# EAGLE design pid_projekat (EAGLE 7.4.0)
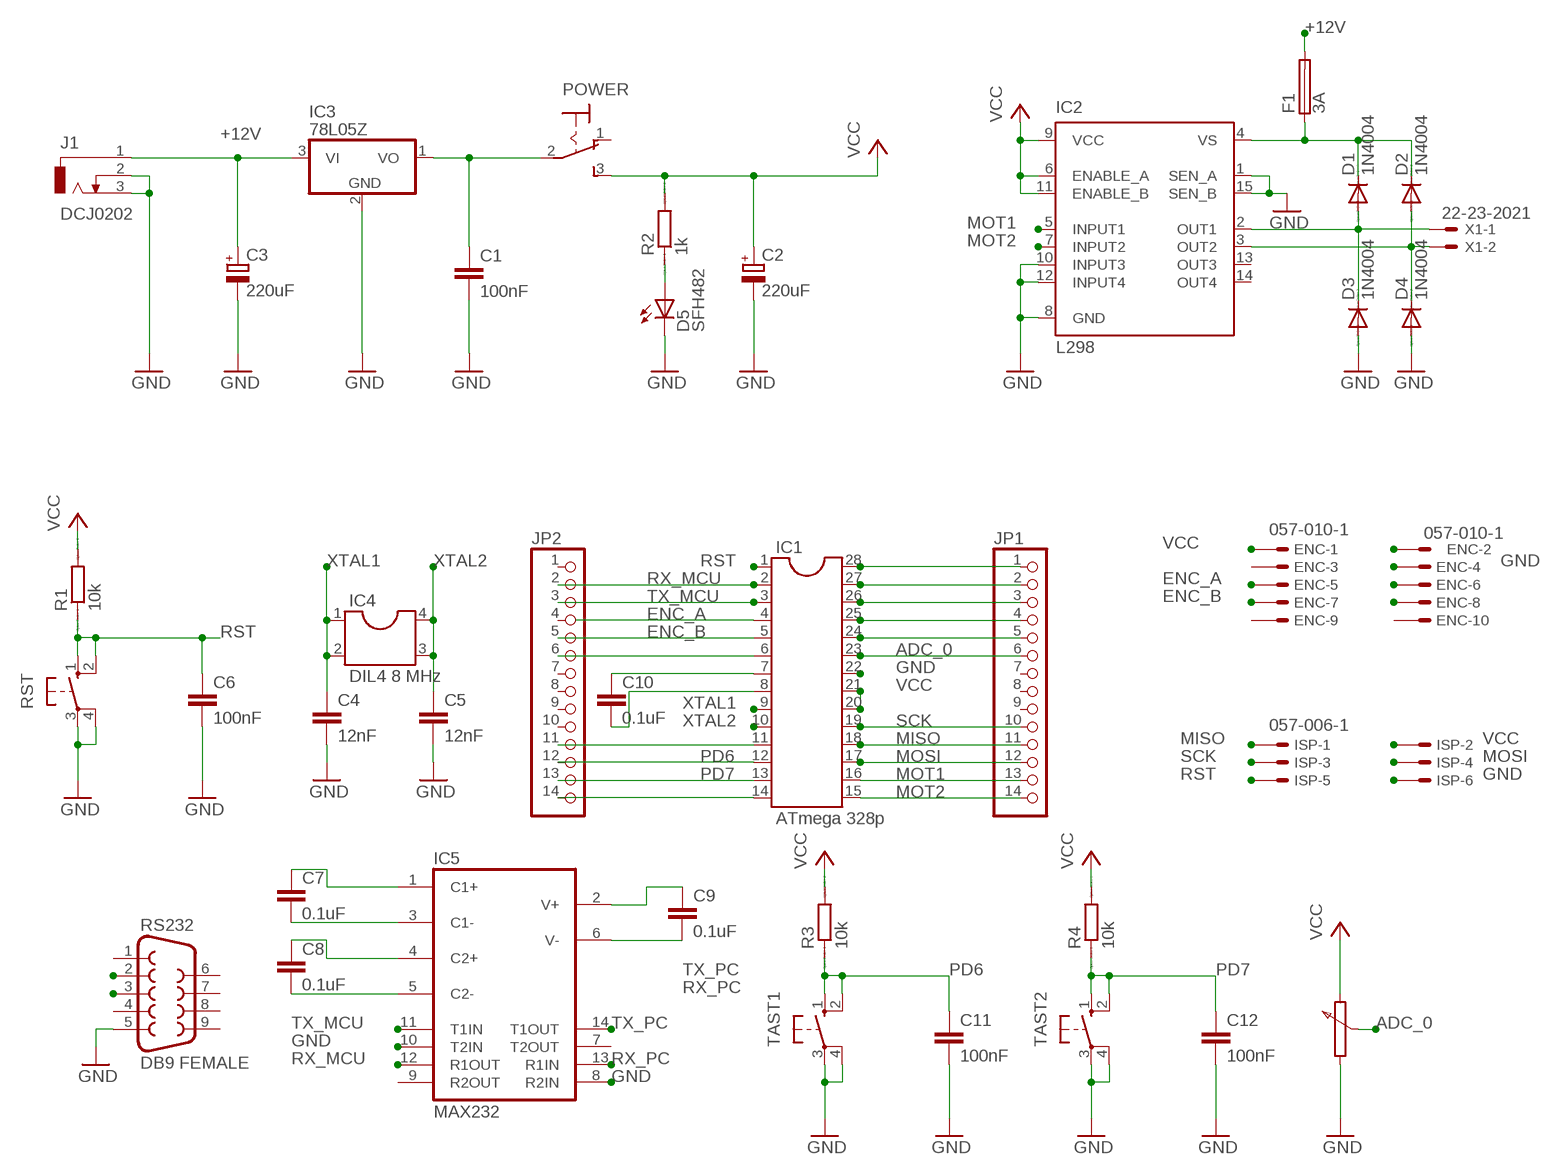
[diagram p0: schematic, sheet 1]

## Parts
C1  100nF  C2,5-3  [C2.5-3]
C2  220uF  CPOL-EUE2,5-6E  [E2,5-6E]
C3  220uF  CPOL-EUE2,5-6E  [E2,5-6E]
C4  12nF  C2,5-3  [C2.5-3]
C5  12nF  C2,5-3  [C2.5-3]
C6  100nF  C2,5-3  [C2.5-3]
C7  0.1uF  C2,5-3  [C2.5-3]
C8  0.1uF  C2,5-3  [C2.5-3]
C9  0.1uF  C2,5-3  [C2.5-3]
C10  0.1uF  C2,5-3  [C2.5-3]
C11  100nF  C2,5-3  [C2.5-3]
C12  100nF  C2,5-3  [C2.5-3]
D1  1N4004  [DO41-10]
D2  1N4004  [DO41-10]
D3  1N4004  [DO41-10]
D4  1N4004  [DO41-10]
D5  SFH482  [SFH482]
ENC  057-010-1  [057-010-1]
F1  3A  GSH15  [GSH15]
IC1  ATmega 328p  DIL28  [DIL28-6]
IC2  L298  [MULTIWATT-15]
IC3  78L05Z  [TO92]
IC4  DIL4 8 MHz  DIL4  [DIL04]
IC5  MAX232  [DIL16]
ISP  057-006-1  [057-006-1]
J1  DCJ0202  [DCJ0202]
JP1  PINHD-1X14  [1X14]
JP2  PINHD-1X14  [1X14]
POWER  320-916  [320-916]
R1  10k  R0204/7  [0204/7]
R2  1k  R0204/7  [0204/7]
R3  10k  R0204/7  [0204/7]
R4  10k  R0204/7  [0204/7]
RS232  DB9 FEMALE  F09HP  [F09HP]
RST  10-XX  [B3F-10XX]
TAST1  10-XX  [B3F-10XX]
TAST2  10-XX  [B3F-10XX]
X1  22-23-2021  [22-23-2021]

## Nets
+12V: C3.+ F1.2 IC3.3(VI) J1.1
ADC_0: IC1.23 JP1.6
ENC_A: ENC.5 IC1.4 IC1.26 JP1.3
ENC_AINV: ENC.6 IC1.24 JP1.5
ENC_B: ENC.7 IC1.5 IC1.25 JP1.4 JP2.5
ENC_BINV: ENC.8
GND: C1.2 C2.- C3.- C4.2 C5.2 C6.2 C11.2 C12.2 D3.A D4.A D5.K(C) ENC.4 IC1.22 IC2.1(SEN_A) IC2.8(GND) IC2.10(INPUT3) IC2.12(INPUT4) IC2.15(SEN_B) IC3.2(GND) IC5.8(R2IN) IC5.10(T2IN) ISP.6 J1.2 J1.3 RS232.5 RST.3(P) RST.4(P1) TAST1.3(P) TAST1.4(P1) TAST2.3(P) TAST2.4(P1)
MISO: IC1.18 ISP.1 JP1.11
MOSI: IC1.17 ISP.4 JP1.12
MOT1: IC1.16 IC1.28 IC2.5(INPUT1) JP1.1 JP1.13
MOT2: IC1.15 IC1.27 IC2.7(INPUT2) JP1.2 JP1.14
MOT+: D1.A D3.C IC2.2(OUT1) X1.1
MOT-: D2.A D4.C IC2.3(OUT2) X1.2
N$1: C9.2 IC5.6(V-)
N$2: C9.1 IC5.2(V+)
N$3: C1.1 IC3.1(VO) POWER.2(P)
N$4: D5.A R2.1
N$8: IC1.6 JP2.6
N$9: ENC.2
N$10: C7.2 IC5.3(C1-)
N$11: C7.1 IC5.1(C1+)
N$12: IC1.11 JP2.11
N$13: C8.1 IC5.4(C2+)
N$15: C8.2 IC5.5(C2-)
N$17: IC1.14 JP2.14
N$21: C10.1 IC1.7
N$22: C10.2 IC1.8
PD6: C11.1 IC1.12 JP2.12 R3.1 TAST1.1(S) TAST1.2(S1)
PD7: C12.1 IC1.13 JP2.13 R4.1 TAST2.1(S) TAST2.2(S1)
RST: C6.1 IC1.1 ISP.5 R1.1 RST.1(S) RST.2(S1)
RX_MCU: IC1.2 IC5.12(R1OUT) JP2.2
RX_PC: IC5.13(R1IN) RS232.3
SCK: IC1.19 ISP.3 JP1.10
TX_MCU: IC1.3 IC5.11(T1IN) JP2.3
TX_PC: IC5.14(T1OUT) RS232.2
VCC: C2.+ ENC.1 IC1.20 IC1.21 IC2.6(ENABLE_A) IC2.9(VCC) IC2.11(ENABLE_B) ISP.2 POWER.3(S) R1.2 R2.2 R3.2 R4.2
VS: D1.C D2.C F1.1 IC2.4(VS)
XTAL1: C4.1 IC1.9 IC4.1 IC4.2
XTAL2: C5.1 IC1.10 IC4.3 IC4.4
Unconnected: ENC.3 ENC.9 ENC.10 IC2.13(OUT3) IC2.14(OUT4) IC5.7(T2OUT) IC5.9(R2OUT) JP1.7 JP1.8 JP1.9 JP2.1 JP2.4 JP2.7 JP2.8 JP2.9 JP2.10 POWER.1(O) RS232.1 RS232.4 RS232.6 RS232.7 RS232.8 RS232.9

## Power pins joined to a net without a drawn wire
GND: IC5.15(GND)
VCC: IC5.16(VCC)

## Library data of the parts
C1 C4-C12 = capacitor-wima:C: CAPACITOR naming: grid - package width
C2 C3 = rcl:CPOL-EU: POLARIZED CAPACITOR, European symbol
D1-D4 = diode:1N4004: DIODE general purpose rectifier, 1 A
D5 = led:SFH482: IR LED infrared emitting diode, Infineon
ENC = con-panduit:057-010-: CONNECTOR 10-pin series 057 contact pc board low profile headers; OC_FARNELL: unknown; OC_NEWARK: unknown
F1 = fuse:GSH15: FUSE HOLDER grid 15mm, 19649 Wickmann; MPN: 64900001039; OC_FARNELL: 1271673; OC_NEWARK: 02P0318
IC1 = ic-package:DIL28: Dual In Line
IC2 = st-microelectronics:L298: DUAL FULL-BRIDGE DRIVER; MPN: L298N; OC_FARNELL: 1589425; OC_NEWARK: 32M1527
IC3 = linear:78*: Positive VOLTAGE REGULATOR Source: http://cache.national.com/ds/LM/LM78L05.pdf http://www.fairchildsemi.com/ds/LM/LM7805.pdf
IC4 = ic-package:DIL4: Dual In Line / Socket
IC5 = maxim:MAX232: RS232 TRANSCEIVER; MF: MAXIM; MPN: MAX232ACPE+; OC_FARNELL: 9723773; OC_NEWARK: 68K4544
ISP = con-panduit:057-006-: CONNECTOR 6-pin series 057 contact pc board low profile headers; OC_FARNELL: unknown; OC_NEWARK: unknown
J1 = con-jack:DCJ0202: DC POWER JACK Source: DCJ0202.pdf; OC_FARNELL: unknown; OC_NEWARK: unknown
JP1 JP2 = pinhead:PINHD-1X14: PIN HEADER
POWER = switch:320-916: TOGGLE SWITCH distributor RS Components
R1-R4 = eagle-ltspice:R: RESISTOR, European symbol; SPICEMODEL: NONE; SPICEPREFIX: R
RS232 = con-subd:F09: SUB-D; OC_FARNELL: unknown; OC_NEWARK: unknown
RST TAST1 TAST2 = switch-omron:10-XX: OMRON SWITCH; MPN: B3F-1000; OC_FARNELL: 176432; OC_NEWARK: 36M3542
X1 = con-molex:22-23-2021: .100" (2.54mm) Center Header - 2 Pin; MF: MOLEX; MPN: 22-23-2021; OC_FARNELL: 1462926; OC_NEWARK: 25C3832

## Board
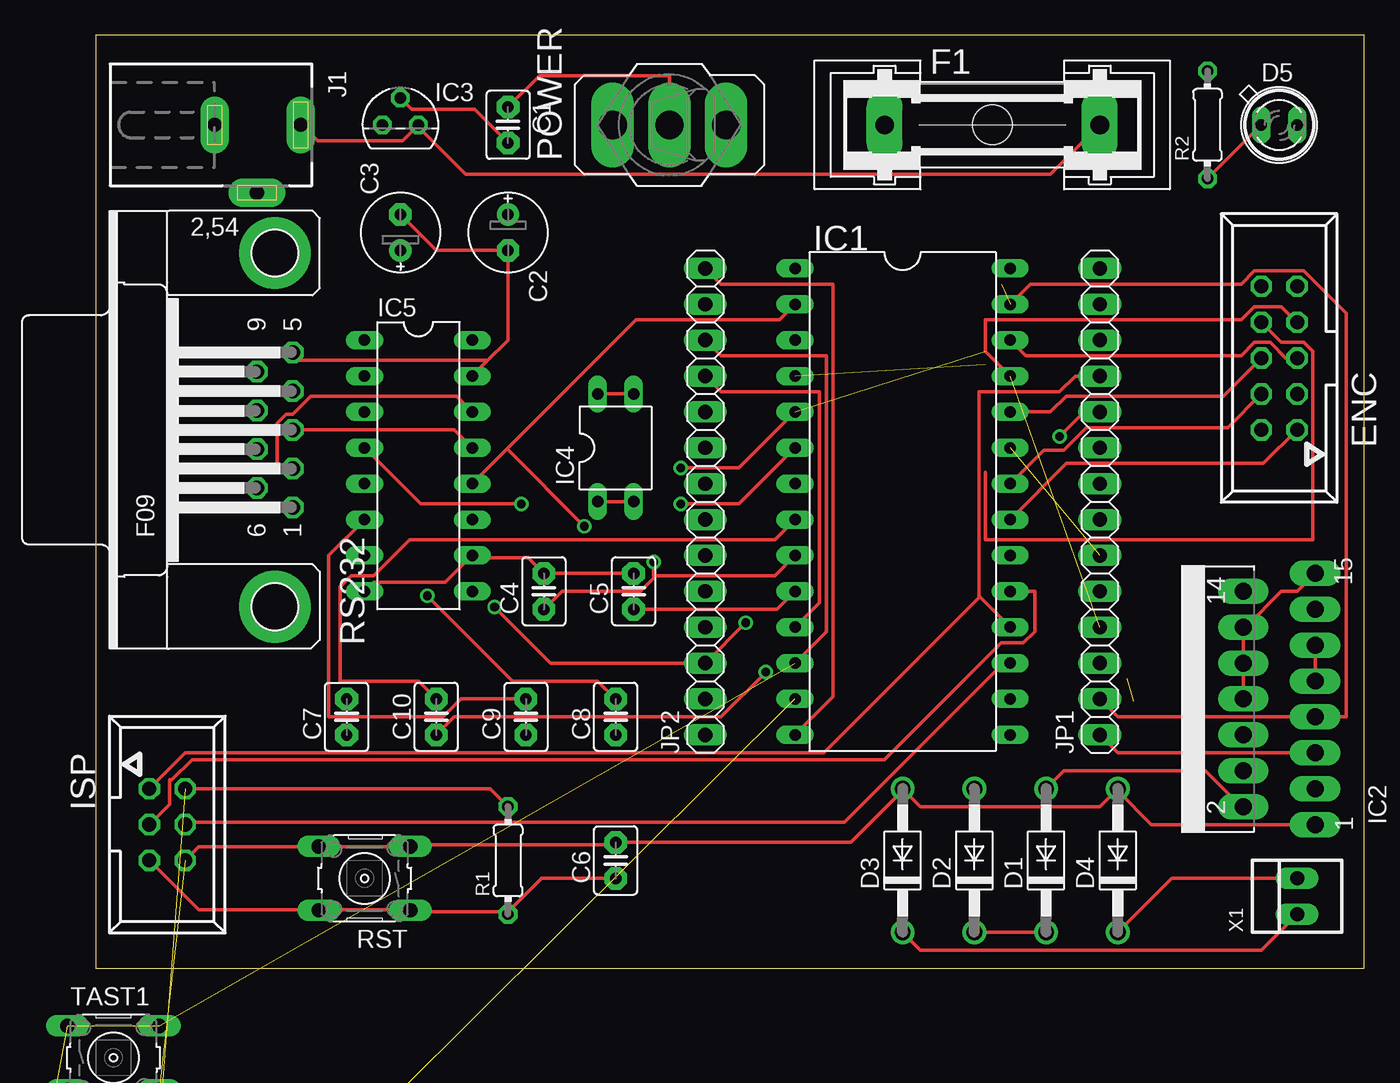
[diagram p1: board, top side]
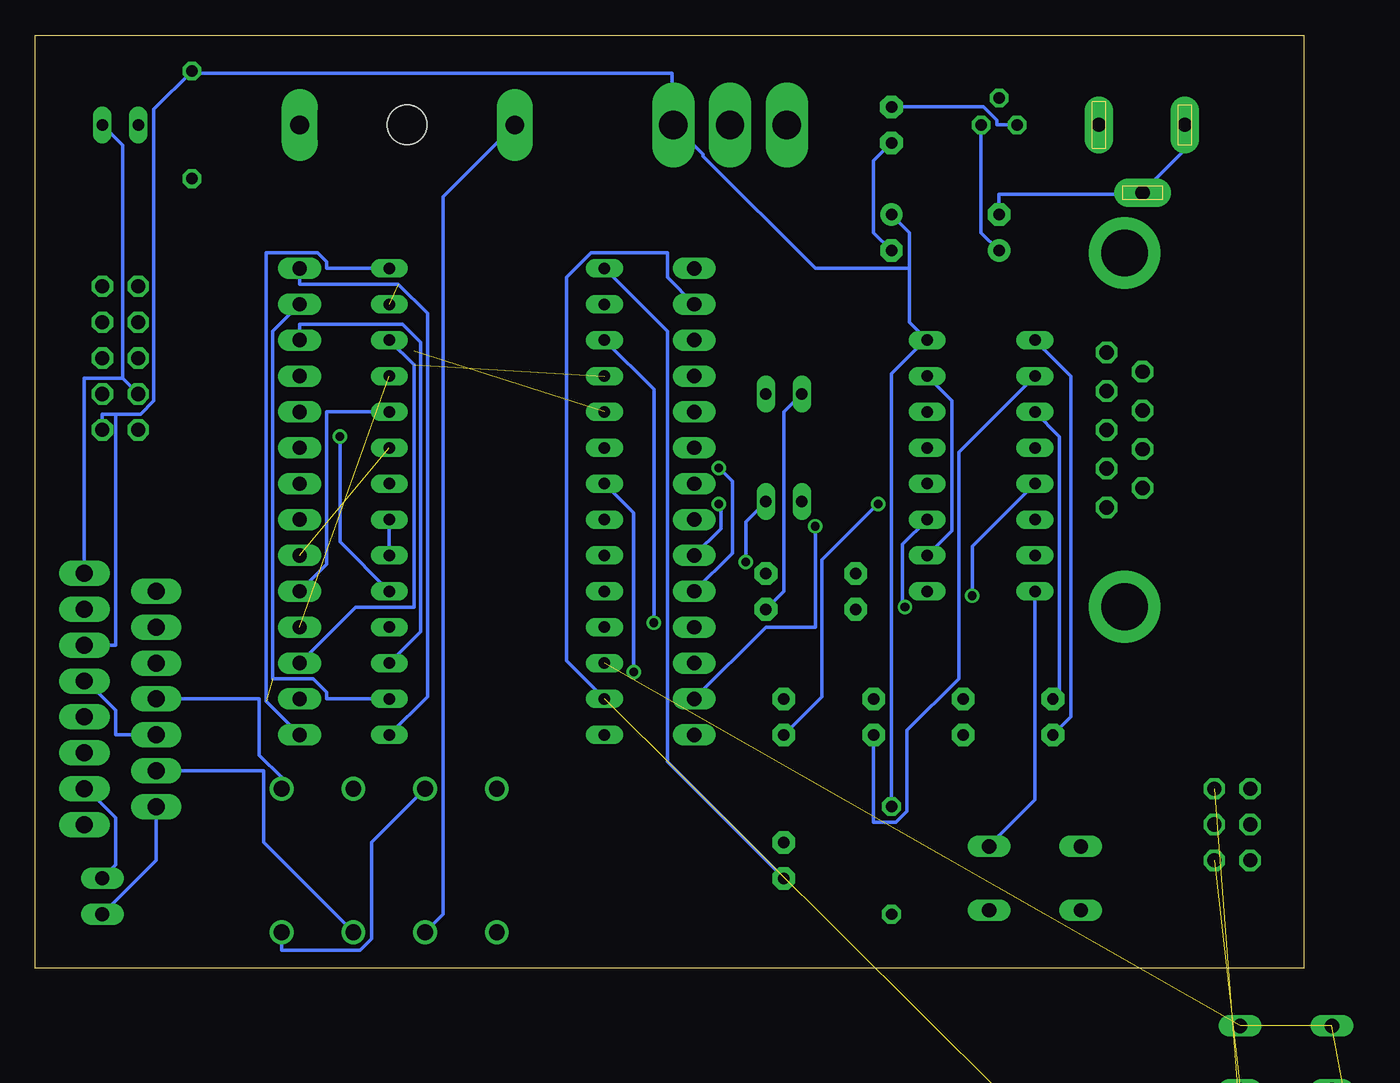
[diagram p2: board, bottom side, seen from below]

Size 89.84 x 66.03 mm. Coordinates in mm from the lower left corner, seen from the top.
Outline: 0,0 89.84,0 89.84,66.03 0,66.03 0,0
Copper layers (1*16): Top 0.035mm / dielectric 1.5mm / Bottom 0.035mm
Design rules "default": minimum track width 10mil, minimum drill 24mil, track to track 8mil, track to pad 8mil, pad to pad 8mil, via to via 8mil, smd to smd 8mil, copper to edge 40mil, drill to drill 8mil, minimum pad ring 10mil, minimum via ring 8mil, stop-mask expansion 4mil, vias tented up to drill 0mil, thermal gap 10mil

### Footprints (pad centres in the part's own frame; a part is rotated, then mirrored left to right if it is on the bottom)
C2.5-3 = drill 0.813 pad 1.6 octagon: 1 -1.27,0; 2 1.27,0
E2,5-6E = drill 0.813 pad 1.575: + -1.27,0 | drill 0.813 pad 1.575 octagon: - 1.27,0
DO41-10 = drill 1.118: A 5.08,0; C -5.08,0
SFH482 = drill 0.813 long: A -1.27,0; K 1.27,0
057-010-1 = drill 1 octagon: 1 -5.08,-1.27; 2 -5.08,1.27; 3 -2.54,-1.27; 4 -2.54,1.27; 5 0,-1.27; 6 0,1.27; 7 2.54,-1.27; 8 2.54,1.27; 9 5.08,-1.27; 10 5.08,1.27
GSH15 = drill 1.321 pad 2.54 long: 1 -7.62,0; 2 7.62,0 | hole 2.794: 0,0
DIL28-6 = drill 0.813 long: 1 -16.51,-7.62; 2 -13.97,-7.62; 3 -11.43,-7.62; 4 -8.89,-7.62; 5 -6.35,-7.62; 6 -3.81,-7.62; 7 -1.27,-7.62; 8 1.27,-7.62; 9 3.81,-7.62; 10 6.35,-7.62; 11 8.89,-7.62; 12 11.43,-7.62; 13 13.97,-7.62; 14 16.51,-7.62; 15 16.51,7.62; 16 13.97,7.62; 17 11.43,7.62; 18 8.89,7.62; 19 6.35,7.62; 20 3.81,7.62; 21 1.27,7.62; 22 -1.27,7.62; 23 -3.81,7.62; 24 -6.35,7.62; 25 -8.89,7.62; 26 -11.43,7.62; 27 -13.97,7.62; 28 -16.51,7.62
MULTIWATT-15 = drill 1.2 long: 1 -8.89,-7.62; 2 -7.62,-2.54; 3 -6.35,-7.62; 4 -5.08,-2.54; 5 -3.81,-7.62; 6 -2.54,-2.54; 7 -1.27,-7.62; 8 0,-2.54; 9 1.27,-7.62; 10 2.54,-2.54; 11 3.81,-7.62; 12 5.08,-2.54; 13 6.35,-7.62; 14 7.62,-2.54; 15 8.89,-7.62
TO92 = drill 0.813 octagon: 1 -1.27,0; 2 0,1.905; 3 1.27,0
DIL04 = drill 0.813 long: 1 -1.27,-3.81; 2 1.27,-3.81; 3 1.27,3.81; 4 -1.27,3.81
DIL16 = drill 0.813 long: 1 -8.89,-3.81; 2 -6.35,-3.81; 3 -3.81,-3.81; 4 -1.27,-3.81; 5 1.27,-3.81; 6 3.81,-3.81; 7 6.35,-3.81; 8 8.89,-3.81; 9 8.89,3.81; 10 6.35,3.81; 11 3.81,3.81; 12 1.27,3.81; 13 -1.27,3.81; 14 -3.81,3.81; 15 -6.35,3.81; 16 -8.89,3.81
057-006-1 = drill 1 octagon: 1 -2.54,-1.27; 2 -2.54,1.27; 3 0,-1.27; 4 0,1.27; 5 2.54,-1.27; 6 2.54,1.27
DCJ0202 = drill 1 pad 2 long: 1 0,3.1; 2 4.8,0; 3 0,-3
1X14 = drill 1.016 long: 1 -16.51,0; 2 -13.97,0; 3 -11.43,0; 4 -8.89,0; 5 -6.35,0; 6 -3.81,0; 7 -1.27,0; 8 1.27,0; 9 3.81,0; 10 6.35,0; 11 8.89,0; 12 11.43,0; 13 13.97,0; 14 16.51,0
320-916 = drill 2.007 long: 1 0,4.013; 2 0,0; 3 0,-4.013
0204/7 = drill 0.813 octagon: 1 -3.81,0; 2 3.81,0
F09HP = drill 1.016 octagon: 1 -5.486,-1.27; 2 -2.743,-1.27; 3 0,-1.27; 4 2.743,-1.27; 5 5.486,-1.27; 6 -4.115,1.27; 7 -1.372,1.27; 8 1.372,1.27; 9 4.115,1.27 | drill 3.302 pad 5.08: G1 -12.522,0; G2 12.522,0
B3F-10XX = drill 1.016 long: 1 -3.251,2.261; 2 3.251,2.261; 3 -3.251,-2.261; 4 3.251,-2.261
22-23-2021 = drill 1 long: 1 -1.27,0; 2 1.27,0

### Placement (x,y rotation side)
C1  29.21,59.69 270 top
C2  29.21,52.07 270 top
C3  21.59,52.07 90 top
C4  31.75,26.67 90 top
C5  38.1,26.67 90 top
C6  36.83,7.62 90 top
C7  17.78,17.78 90 top
C8  36.83,17.78 90 top
C9  30.48,17.78 90 top
C10  24.13,17.78 90 top
C11  -2.54,-13.97 0 top  (outside the outline)
C12  -2.54,-35.56 0 top  (outside the outline)
D1  67.31,7.62 90 top
D2  62.23,7.62 90 top
D3  57.15,7.62 90 top
D4  72.39,7.62 90 top
D5  83.82,59.69 0 top
ENC  83.82,43.18 90 top
F1  63.5,59.69 0 top
IC1  57.15,33.02 270 top
IC2  78.74,19.05 90 top
IC3  21.59,59.69 0 top
IC4  36.83,36.83 0 top
IC5  22.86,35.56 270 top
ISP  5.08,10.16 270 top
J1  11.43,59.69 270 top
JP1  71.12,33.02 90 top
JP2  43.18,33.02 90 top
POWER  40.64,59.69 90 top
R1  29.21,7.62 90 top
R2  78.74,59.69 90 top
R3  0,-20.32 0 top  (outside the outline)
R4  0,-41.91 0 top  (outside the outline)
RS232  12.7,38.1 90 top
RST  19.05,6.35 180 top
TAST1  1.27,-6.35 0 top  (outside the outline)
TAST2  1.27,-27.94 0 top  (outside the outline)
X1  85.09,5.08 90 top

### Tracks (layer width: path | path; a pad name or v marks a point on that pad's centre or on a via)
+12V
  Top 0.254: J1.1 14.61,59.69 15.72,58.58 21.75,58.58 IC3.3 22.86,59.53 26.19,56.2 67.63,56.2 F1.2
  Bottom 0.254: C3.+ 22.86,52.07 IC3.3
ADC_0  (1 unrouted)
ENC_A  (1 unrouted)
  Top 0.254: IC1.26 65.88,43.34 81.12,43.34 82.07,44.29 83.19,44.29 84.3,43.18 ENC.5
  Bottom 0.254: JP1.3 67.15,25.56 63.02,25.56 63.02,42.7 IC1.26
ENC_AINV
  Top 0.254: ENC.6 79.85,40.48 68.74,40.48 67.63,39.37 IC1.24
  Bottom 0.254: IC1.24 69.22,39.37 69.22,28.57 JP1.5
ENC_B  (via drill 0.61)  (2 unrouted)
  Top 0.254: IC1.25 63.02,43.66 63.02,45.88 81.12,45.88 82.07,46.83 83.98,46.83 ENC.7 | IC1.5 45.56,35.4 v41.43,35.4
  Bottom 0.254: v41.43,35.4 40.48,34.45 40.48,29.37 JP2.5
ENC_BINV
  Top 0.254: 63.02,35.08 63.02,30.32 70.01,30.32 70.09,30.24 70.17,30.32 86.2,30.32 86.2,43.66 85.57,44.29 83.98,44.29 ENC.8
GND  (6 unrouted)
  Top 0.254: IC1.22 67.15,36.67 68.58,36.67 70.17,38.26 80.17,38.26 ENC.4 | IC2.8 IC2.10 IC2.12 81.44,24.13 83.98,26.67 85.09,26.67 IC2.15 | IC2.1 74.77,10.16 72.39,12.54 D4.A 71.12,11.43 58.42,11.43 D3.A 57.15,12.54 53.5,8.89 C6.2 36.67,8.73 22.38,8.73 RST.3 22.23,8.57 15.88,8.57 RST.4 15.72,8.57 7.3,8.57 ISP.6 | IC5.8 19.68,27.3 24.77,27.3 IC5.10 26.67,29.05 30.64,29.05 C4.2 C5.2 | IC3.2 22.38,60.8 26.83,60.8 C1.2 | 27.7,42.94 29.21,44.45 C2.- 24.13,50.8 C3.- | 27.7,42.94 IC5.15 | RS232.5 13.97,43.5 14.45,43.02 27.62,43.02 27.7,42.94
  Bottom 0.254: D5.K 83.66,58.26 83.66,41.75 | ENC.4 83.66,41.75 | IC2.8 73.98,19.05 73.98,15.08 72.39,13.49 D4.A | 83.66,41.75 86.36,41.75 IC2.15 | J1.3 8.57,59.69 8.57,57.78 11.43,54.93 J1.2 11.43,54.77 21.59,54.77 C3.- | C1.2 30.48,57.15 30.48,52.07 C2.- | IC5.10 24.92,30.96 24.92,40.16 IC5.15 | IC5.8 19.05,11.91 22.23,8.73 RST.3
MISO
  Top 0.254: 62.63,26.27 62.55,26.35 62.55,40.8 68.26,40.8 69.37,41.91 JP1.11 | 62.63,26.27 IC1.18 | ISP.1 6.35,15.24 51.59,15.24 62.63,26.27
MOSI
  Top 0.254: ISP.4 6.51,10.32 53.02,10.32 64.29,21.59 IC1.17
  Bottom 0.254: IC1.17 62.55,23.81 62.55,44.29 63.82,45.56 71.12,45.56 JP1.12
MOT1  (1 unrouted)
  Top 0.254: IC2.5 72.39,15.24 JP1.1
  Bottom 0.254: IC1.28 69.22,49.53 69.22,50.01 69.85,50.64 73.5,50.64 73.5,18.89 JP1.1 | IC1.16 69.22,19.05 69.22,19.53 70.17,20.48 73.03,20.48 73.03,45.09 JP1.13
MOT2  (1 unrouted)
  Top 0.254: IC1.27 66.2,48.42 81.12,48.42 82.07,49.37 85.57,49.37 88.58,46.35 88.58,17.78 IC2.7 72.39,17.78 JP1.2
  Bottom 0.254: IC1.15 62.07,19.21 62.07,46.35 64.14,48.42 71.12,48.42 JP1.14
MOT+
  Top 0.254: D3.C 58.42,1.27 82.55,1.27 X1.1 | D1.A 68.58,13.97 78.58,13.97 81.12,11.43 IC2.2
  Bottom 0.254: X1.1 81.28,7.62 IC2.2
MOT-
  Top 0.254: D4.C 76.2,6.35 X1.2
  Bottom 0.254: X1.2 84.14,7.3 84.14,10.64 86.2,12.7 IC2.3 | D2.A 66.04,8.89 66.04,2.06 66.83,1.27 72.39,1.27 D4.C
N$1
  Top 0.254: IC5.6 16.51,29.21 16.51,17.78 24.61,17.78 25.88,19.05 C9.2
N$2
  Bottom 0.254: IC5.2 24.45,36.51 24.45,20.48 28.1,16.83 28.1,11.11 28.89,10.32 30.48,10.32 C9.1
N$3
  Top 0.254: POWER.2 40.64,63.18 31.43,63.18 C1.1
  Bottom 0.254: IC3.1 21.75,59.69 21.75,60.01 22.7,60.96 C1.1
N$4
  Top 0.254: D5.A R2.1
N$8  (via drill 0.61)
  Top 0.254: IC1.6 45.56,32.86 v41.43,32.86
  Bottom 0.254: v41.43,32.86 41.27,32.7 41.27,31.11 JP2.6
N$10
  Bottom 0.254: IC5.3 17.3,37.62 17.3,19.53 C7.2
N$11
  Bottom 0.254: IC5.1 16.51,41.91 16.51,17.78 C7.1
N$12
  Top 0.254: IC1.11 51.28,25.88 51.28,40.8 44.29,40.8 JP2.11
N$13  (via drill 0.61)
  Top 0.254: IC5.4 23.02,32.86 v30.16,32.86
  Bottom 0.254: v30.16,32.86 34.13,28.89 34.13,19.21 C8.1
N$15  (via drill 0.61)
  Top 0.254: v23.5,26.35 29.53,20.32 35.56,20.32 C8.2
  Bottom 0.254: IC5.5 23.5,29.84 v23.5,26.35
N$17
  Top 0.254: IC1.14 52.23,19.21 52.23,48.42 44.29,48.42 JP2.14
N$21  (via drill 0.61)
  Top 0.254: v47.47,20.95 44.29,17.78 25.4,17.78 C10.1
  Bottom 0.254: IC1.7 47.47,32.23 v47.47,20.95
N$22
  Top 0.254: IC1.8 48.1,30.32 22.23,30.32 19.68,27.78 18.1,27.78 17.3,26.99 17.3,20.32 22.86,20.32 C10.2
PD6  (4 unrouted)
  Top 0.254: IC1.12 51.75,23.81 51.75,43.34 44.29,43.34 JP2.12
PD7  (4 unrouted)
  Bottom 0.254: IC1.13 52.23,21.75 52.23,48.9 50.48,50.64 45.09,50.64 45.09,48.9 JP2.13
RST
  Top 0.254: ISP.5 7.3,4.13 15.72,4.13 RST.2 15.88,4.13 22.23,4.13 RST.1 22.38,3.97 29.05,3.97 R1.1 29.21,3.97 31.59,6.35 C6.1
  Bottom 0.254: IC1.1 45.09,45.09 45.09,14.61 C6.1
RX_MCU  (via drill 0.61)
  Top 0.254: 29.13,36.75 38.26,45.88 48.42,45.88 IC1.2 | 29.13,36.75 IC5.12 | 29.13,36.75 v34.61,31.27
  Bottom 0.254: JP2.2 38.1,24.13 34.61,24.13 v34.61,31.27
RX_PC
  Top 0.254: IC5.13 25.4,38.1 RS232.3
SCK  (via drill 0.61)
  Top 0.254: v68.26,37.62 70.01,39.37 JP1.10 | ISP.3 5.24,11.59 5.24,13.34 5.4,13.34 6.83,14.76 55.88,14.76 64.14,23.02 65.72,23.02 66.52,23.81 66.52,26.67 IC1.19
  Bottom 0.254: IC1.19 68.26,30.16 v68.26,37.62
TX_MCU  (via drill 0.61)
  Top 0.254: v28.26,25.56 32.23,21.59 JP2.3 v46.04,24.45
  Bottom 0.254: IC5.11 28.42,30 28.42,25.72 v28.26,25.56 | IC1.3 46.04,40.96 v46.04,24.45
TX_PC
  Top 0.254: IC5.14 25.56,40.48 15.24,40.48 13.97,39.21 13.49,39.21 12.86,38.58 12.86,35.4 13.97,35.4 RS232.2
VCC  (2 unrouted)
  Top 0.254: IC2.9 IC2.11 | IC1.21 68.74,35.72 82.71,35.72 ENC.1 | R1.2 27.94,12.7 ISP.2
  Bottom 0.254: IC2.6 84.14,16.51 84.14,18.26 86.2,20.32 IC2.9 | IC1.21 IC1.20 | 84.14,39.21 85.09,39.21 ENC.1 | 84.14,39.21 82.39,39.21 81.44,40.16 81.44,60.8 R2.2 78.74,63.34 44.77,63.34 44.77,59.69 POWER.3 44.61,59.69 42.55,57.63 42.55,57.47 34.61,49.53 27.94,49.53 | IC2.11 84.14,22.86 84.14,39.21 | 27.94,49.53 27.94,52.07 C2.+ | 27.94,49.53 27.94,45.72 IC5.16 26.83,44.45 29.21,42.07 R1.2
VS
  Top 0.254: D1.C D2.C
  Bottom 0.254: IC2.4 73.66,13.97 73.66,8.89 D1.C | F1.1 60.96,54.61 60.96,3.81 D2.C
XTAL1  (via drill 0.61)
  Top 0.254: IC4.2 IC4.1 | IC1.9 48.1,27.78 39.69,27.78 39.61,27.7 | 39.61,27.7 38.58,26.67 33.02,26.67 C4.1 | v39.53,28.73 39.53,27.78 39.61,27.7
  Bottom 0.254: IC4.2 39.53,31.59 v39.53,28.73
XTAL2
  Top 0.254: IC4.3 IC4.4 | IC1.10 48.26,25.4 C5.1
  Bottom 0.254: IC4.4 36.83,39.37 36.83,26.67 C5.1